# EAGLE design DACv4-Controller (EAGLE 7.6.0)
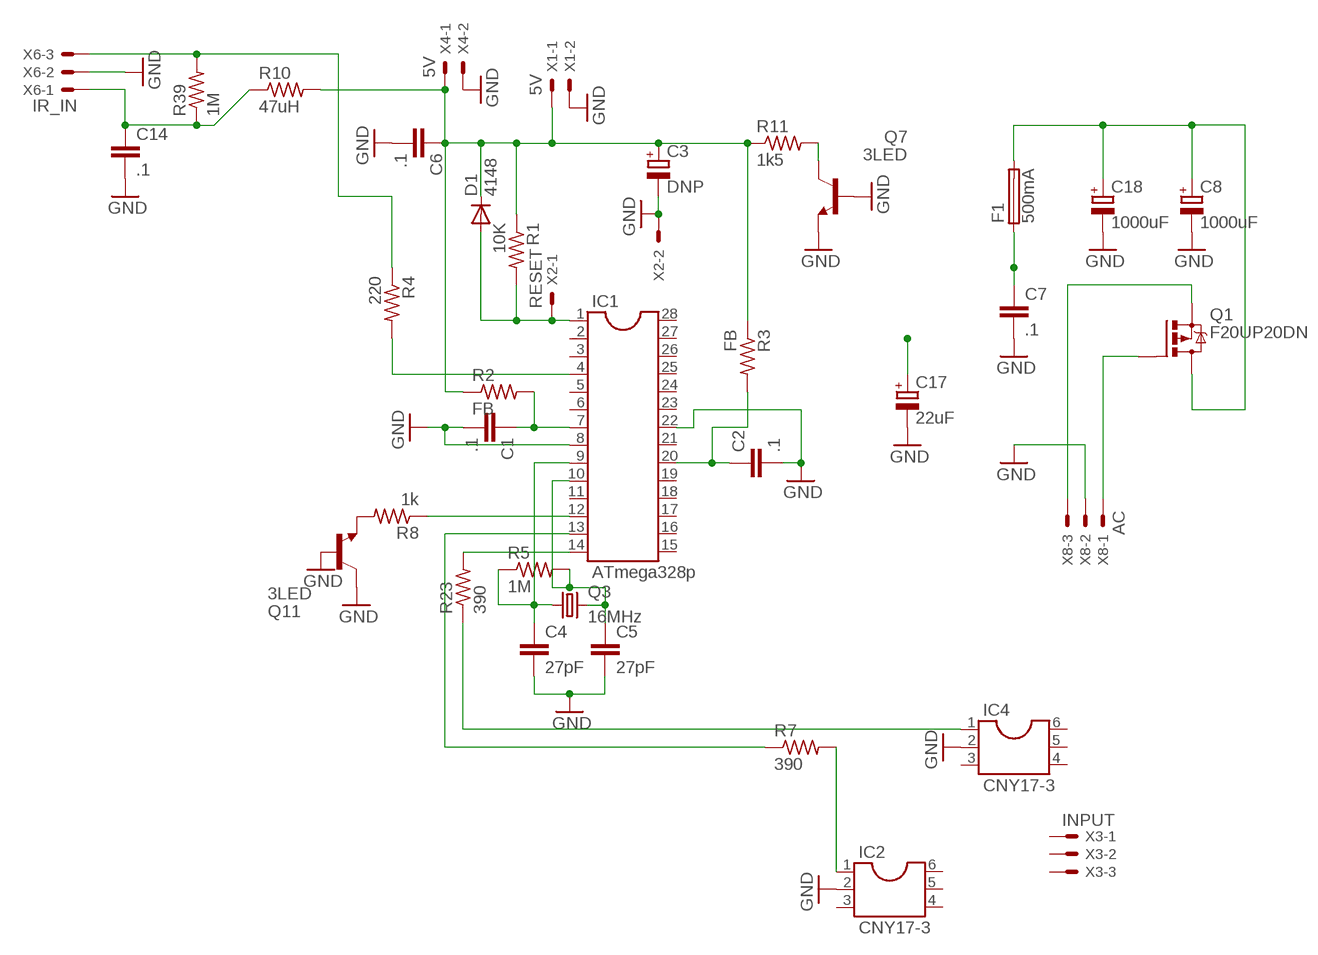
[diagram p0: schematic, sheet 1]

## Parts
C1  .1  C-EUC1210K  [C1210K]
C2  .1  C-EUC1210K  [C1210K]
C3  DNP  CPOL-EUE3.5-10  [E3,5-10]
C4  27pF  C-EUC1210K  [C1210K]
C5  27pF  C-EUC1210K  [C1210K]
C6  .1  C-EUC1210K  [C1210K]
C7  .1  C-EUC1210K  [C1210K]
C8  1000uF  CPOL-EUE5-13  [E5-13]
C14  .1  C-EUC1210K  [C1210K]
C17  22uF  CPOL-EUE3.5-10  [E3,5-10]
C18  1000uF  CPOL-EUE5-13  [E5-13]
D1  4148  1N4148DO35-7  [DO35-7]
F1  500mA  19560  [19560]
IC1  ATmega328p  DIL28-3  [DIL28-3]
IC2  CNY17-3  DIL6  [DIL06]
IC4  CNY17-3  DIL6  [DIL06]
Q1  F20UP20DN  IRF9530  [TO220BV]
Q3  16MHz  CRYSTALHC49S  [HC49/S]
Q7  3LED  BC546A  [TO92-EBC]
Q11  3LED  BC546A  [TO92-EBC]
R1  10K  R-US_0309/10  [0309/10]
R2  FB  R-US_0309/10  [0309/10]
R3  FB  R-US_0309/12  [0309/12]
R4  220  R-US_0309/12  [0309/12]
R5  1M  R-US_0309/V  [0309V]
R7  390  R-US_0309/10  [0309/10]
R8  1k  R-US_0204/7  [0204/7]
R10  47uH  R-US_0309/10  [0309/10]
R11  1k5  R-US_0309/12  [0309/12]
R23  390  R-US_0309/10  [0309/10]
R39  1M  R-US_0309/10  [0309/10]
X1  5V  22-23-2021  [22-23-2021]
X2  RESET  22-23-2021  [22-23-2021]
X3  INPUT  22-23-2031  [22-23-2031]
X4  5V  22-23-2021  [22-23-2021]
X6  IR_IN  22-23-2031  [22-23-2031]
X8  AC  22-23-2031  [22-23-2031]

## Nets
GND: C1.2 C2.2 C3.- C4.2 C5.2 C6.2 C7.2 C8.- C14.2 C17.- C18.- IC1.8 IC1.22 IC2.2 IC4.2 Q7.B Q7.E Q11.B Q11.C X1.2 X2.2 X4.2 X6.2 X8.2
N$1: IC2.1 R7.2
N$2: D1.A IC1.1 R1.2 X2.1
N$3: IC1.4 R4.2
N$4: C2.1 IC1.20 R3.2
N$5: R4.1 R39.2 X6.3
N$7: IC1.13 R7.1
N$8: IC1.12 R8.1
N$13: C4.1 IC1.9 Q3.1 R5.1
N$14: C5.1 IC1.10 Q3.2 R5.2
N$15: C17.+
N$18: C7.1 F1.1
N$20: C14.1 R10.1 R39.1 X6.1
N$22: Q7.C R11.2
N$24: C8.+ C18.+ F1.2 Q1.D
N$25: Q1.S X8.3
N$26: Q1.G X8.1
N$32: C3.+ C6.1 D1.C R1.1 R2.1 R3.1 R10.2 R11.1 X1.1 X4.1
N$35: C1.1 IC1.7 R2.2
N$41: IC1.14 R23.2
N$44: IC4.1 R23.1
N$55: Q11.E R8.2
Unconnected: IC1.2 IC1.3 IC1.5 IC1.6 IC1.11 IC1.15 IC1.16 IC1.17 IC1.18 IC1.19 IC1.21 IC1.23 IC1.24 IC1.25 IC1.26 IC1.27 IC1.28 IC2.3 IC2.4 IC2.5 IC2.6 IC4.3 IC4.4 IC4.5 IC4.6 X3.1 X3.2 X3.3

## Library data of the parts
C1 C2 C4-C7 C14 = resistor:C-EU: CAPACITOR, European symbol
C3 C8 C17 C18 = resistor:CPOL-EU: POLARIZED CAPACITOR, European symbol
D1 = diode:1N4148: DIODE high speed (Philips)
F1 = fuse:19560: FUSE HOLDER TR5, Wickmann; MPN: 56000001009; OC_FARNELL: 1185363; OC_NEWARK: 15P8392
IC1 = ic-package:DIL28: Dual In Line
IC2 IC4 = ic-package:DIL6: Dual In Line / Socket
Q1 = transistor-power:IRF9530: P-CHANNEL HEXFET POWER-MOS-FET Source: http://www.irf.com/product-info/datasheets/data/irf9530.pdf
Q3 = crystal:CRYSTAL: CRYSTAL; OC_FARNELL: 1667008; OC_NEWARK: unknown
Q7 Q11 = transistor-npn:BC546*: NPN Transistor
R1-R5 R7 R8 R10 R11 R23 R39 = resistor:R-US_: RESISTOR, American symbol
X1 X2 X4 = con-molex:22-23-2021: .100" (2.54mm) Center Header - 2 Pin; MF: MOLEX; MPN: 22-23-2021; OC_FARNELL: 1462926; OC_NEWARK: 25C3832
X3 X6 X8 = con-molex:22-23-2031: .100" (2.54mm) Center Header - 3 Pin; MF: MOLEX; MPN: 22-23-2031; OC_FARNELL: 1462950; OC_NEWARK: 30C0862

## Board
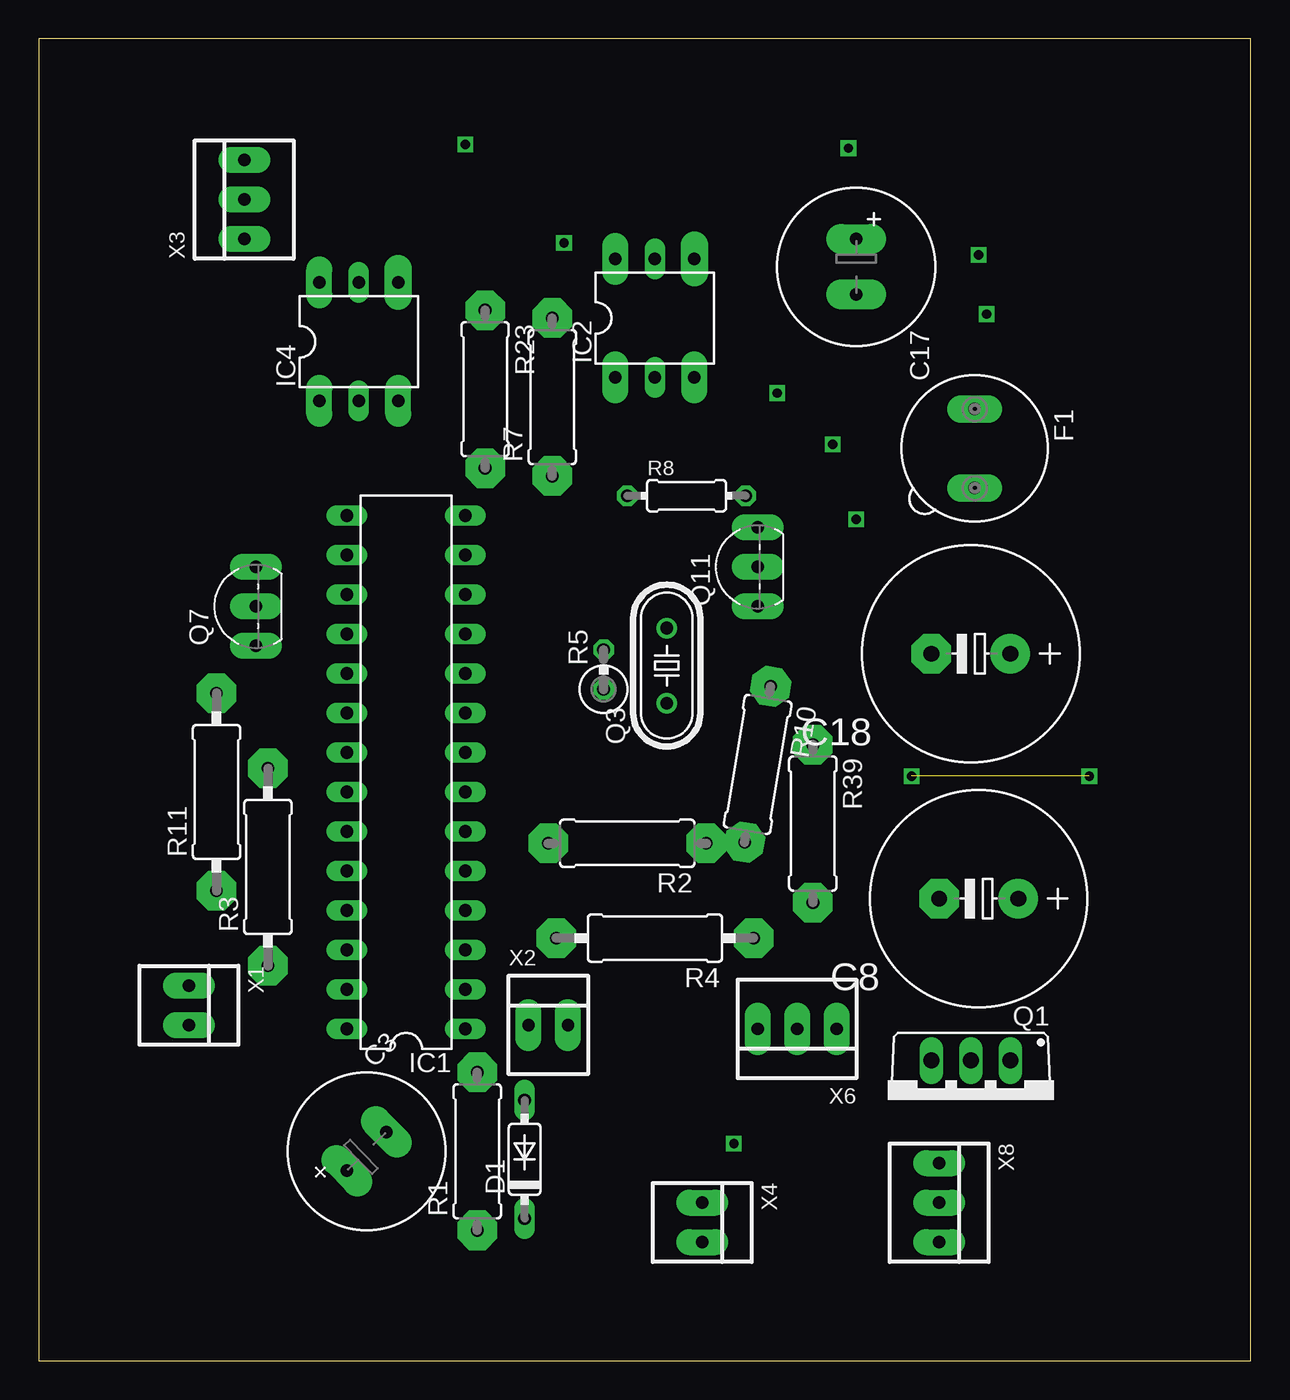
[diagram p1: board, top side]
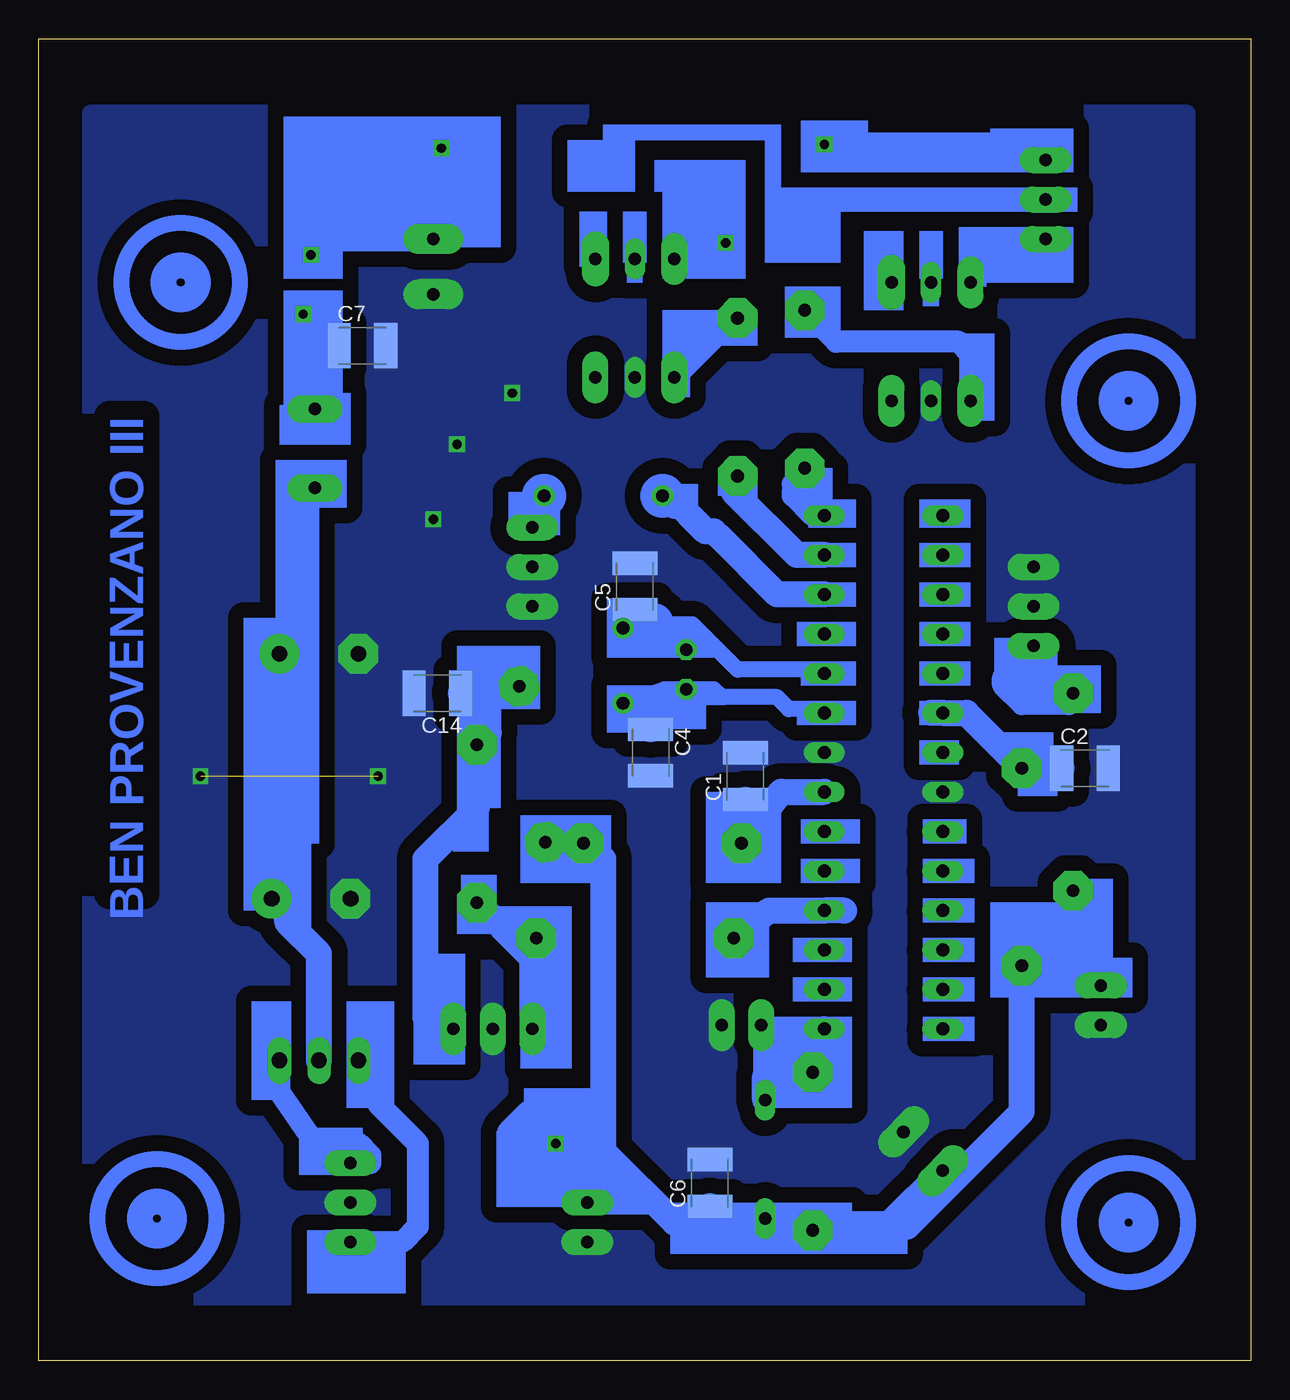
[diagram p2: board, bottom side, seen from below]

Size 77.96 x 85.01 mm. Coordinates in mm from the lower left corner, seen from the top.
Outline: 0,0 77.96,0 77.96,85.01 0,85.01 0,0
Copper layers (1*16): Top 0.035mm / dielectric 1.5mm / Bottom 0.035mm
Design rules "default": minimum track width 10mil, minimum drill 24mil, track to track 8mil, track to pad 8mil, pad to pad 8mil, via to via 8mil, smd to smd 8mil, copper to edge 40mil, drill to drill 8mil, minimum pad ring 10mil, minimum via ring 8mil, stop-mask expansion 4mil, vias tented up to drill 0mil, thermal gap 10mil

### Footprints (pad centres in the part's own frame; a part is rotated, then mirrored left to right if it is on the bottom)
C1210K = smd 1.5 x 2.9: 1 -1.5,0; 2 1.5,0
E3,5-10 = drill 0.813 pad 1.93 long: + -1.778,0; - 1.778,0
E5-13 = drill 1.016 pad 2.54: + -2.54,0 | drill 1.016 pad 2.54 octagon: - 2.54,0
DO35-7 = drill 0.813 long: A 3.81,0; C -3.81,0
19560 = drill 0.813 pad 1.778 long: 1 -2.54,0; 2 2.54,0
DIL28-3 = drill 0.813 long: 1 -16.51,-3.81; 2 -13.97,-3.81; 3 -11.43,-3.81; 4 -8.89,-3.81; 5 -6.35,-3.81; 6 -3.81,-3.81; 7 -1.27,-3.81; 8 1.27,-3.81; 9 3.81,-3.81; 10 6.35,-3.81; 11 8.89,-3.81; 12 11.43,-3.81; 13 13.97,-3.81; 14 16.51,-3.81; 15 16.51,3.81; 16 13.97,3.81; 17 11.43,3.81; 18 8.89,3.81; 19 6.35,3.81; 20 3.81,3.81; 21 1.27,3.81; 22 -1.27,3.81; 23 -3.81,3.81; 24 -6.35,3.81; 25 -8.89,3.81; 26 -11.43,3.81; 27 -13.97,3.81; 28 -16.51,3.81
DIL06 = drill 0.813 pad 1.676 long: 1 -2.54,-3.81; 3 2.54,-3.81; 6 -2.54,3.81 | drill 0.813 long: 2 0,-3.81; 5 0,3.81 | drill 0.813 pad 1.778 long: 4 2.54,3.81
TO220BV = drill 1.016 long: D 0,-2.54; G -2.54,-2.54; S 2.54,-2.54
HC49/S = drill 0.813: 1 -2.413,0; 2 2.413,0
TO92-EBC = drill 0.813 pad 1.676 long: B 0,-1.27; C -2.54,-1.27; E 2.54,-1.27
0309/10 = drill 0.813 pad 2.54 octagon: 1 -5.08,0; 2 5.08,0
0309/12 = drill 0.813 pad 2.54 octagon: 1 -6.35,0; 2 6.35,0
0309V = drill 0.813 octagon: 1 -1.27,0; 2 1.27,0
0204/7 = drill 0.813 octagon: 1 -3.81,0; 2 3.81,0
22-23-2021 = drill 0.8 pad 1.676 long: 1 -1.27,0; 2 1.27,0
22-23-2031 = drill 0.8 pad 1.676 long: 1 -2.54,0; 2 0,0; 3 2.54,0

### Placement (x,y rotation side)
C1  32.51,37.59 90 bottom
C2  10.67,38.1 0 bottom
C3  21.08,13.46 44.6 top
C4  38.61,39.12 270 bottom
C5  39.62,49.78 90 bottom
C6  34.8,11.43 90 bottom
C7  57.15,65.28 0 bottom
C8  60.45,29.72 180 top
C14  52.32,42.93 180 bottom
C17  52.58,70.36 270 top
C18  59.94,45.47 180 top
D1  31.24,12.95 90 top
F1  60.2,58.67 270 top
IC1  23.62,37.85 90 top
IC2  39.62,67.06 0 top
IC4  20.57,65.53 0 top
Q1  59.94,16.76 180 top
Q3  40.39,44.7 90 top
Q7  12.7,48.51 90 top
Q11  44.96,51.05 90 top
R1  28.19,13.46 90 top
R2  37.85,33.27 180 top
R3  14.73,31.75 90 top
R4  39.62,27.18 180 top
R5  36.32,44.45 90 top
R7  33.02,61.98 90 top
R8  41.66,55.63 0 top
R10  46.23,38.35 260.5 top
R11  11.43,36.58 90 top
R23  28.7,62.48 270 top
R39  49.78,34.54 270 top
X1  9.65,22.86 270 top
X2  32.77,21.59 0 top
X3  13.21,74.68 90 top
X4  42.67,8.89 270 top
X6  48.77,21.34 180 top
X8  57.91,10.16 270 top

### Tracks (layer width: path | path; a pad name or v marks a point on that pad's centre or on a via)
GND  (via drill 0.6)  (1 unrouted)
  other vias: 56.13,37.59 47.5,62.23 52.58,54.1 67.56,37.59 51.05,58.93
  pour Bottom (isolate 1.016, no thermals): 4.06,4.06 4.06,80.26 74.68,80.26 74.68,4.06
N$1
  Bottom 1.422: IC2.1 33.27,67.06 R7.2
N$2
  Bottom 1.676: R1.2 27.43,19.3 27.43,20.57 | 27.43,20.57 IC1.1 | X2.1 30.99,20.57 28.96,20.57 | 28.96,20.57 27.43,20.57 | D1.A 31.24,18.29 28.96,20.57
N$3
  Bottom 1.676: R4.2 30.99,28.96 IC1.4 26.16,28.96
N$4
  Bottom 1.676: 20.57,41.66 IC1.20 18.29,41.66 R3.2 C2.1
N$5
  Bottom 1.676: R39.2 46.61,26.29 | 46.61,26.29 46.23,25.91 X6.3 | R4.1 46.36,26.29 46.61,26.29
N$6
  Bottom 1.676: 27.69,8.89 27.43,8.89
N$7
  Bottom 1.422: 33.27,55.88 33.02,55.88 R7.1
  Bottom 1.676: IC1.13 29.21,51.82 33.27,55.88
N$8
  Bottom 1.422: 34.29,53.09 34.54,53.34 | 36.83,54.86 37.08,54.86 R8.1
  Bottom 1.676: IC1.12 30.48,49.28 34.29,53.09 | 34.54,53.34 35.05,53.34 37.34,55.63 R8.1
N$9  (via drill 0.6)
  other vias: 33.78,71.88
N$10  (via drill 0.6)
  other vias: 27.43,78.23
N$11
  Bottom 1.422: 42.67,16 46.48,16 47.75,14.73 47.75,13.72 47.5,13.46 46.23,14.73
N$12  (via drill 0.6)
  other vias: 44.7,13.97
N$13
  Bottom 1.016: IC1.9 27.69,41.91 29.72,41.91 30.48,42.67 34.04,42.67 34.54,43.18 R5.1 37.59,43.18 37.72,43.18 Q3.1
  Bottom 1.676: 38.08,42.67 C4.1 38.51,42.39 Q3.1
N$14
  Bottom 1.016: IC1.10 27.43,44.45 33.02,44.45 35.92,47.35 38.86,47.35 | Q3.2 36.7,45.72 R5.2 | C5.1 40.58,47.33 39.36,47.33
  Bottom 1.676: Q3.2 38.86,47.35 39.36,47.33
N$16  (via drill 0.6)
  other vias: 52.07,77.98
N$17  (via drill 0.6)
  other vias: 60.45,71.12
N$18
  Bottom 1.016: C7.1 58.9,65.02 60.96,65.02 60.2,64.26 F1.1
N$19  (via drill 0.6)
  other vias: 60.96,67.31
N$20
  Bottom 1.676: 49.02,43.43 49.02,40.39 R39.1 49.78,35.56 53.09,32.26 53.09,22.1 X6.1 | 49.02,43.43 C14.1 | R10.1 49.02,43.43
N$22
  Bottom 1.27: R11.2 11.68,42.67 11.68,42.16 14.73,42.16 16,43.43 16,43.94 Q7.C
N$24
  Bottom 1.422: F1.2 61.98,52.83 61.98,45.72 | 61.98,45.72 C8.+ | C18.+ 61.98,45.72
  Bottom 1.676: Q1.D 59.94,26.16 61.98,28.19 61.98,29.72 62.99,30.73 C8.+
N$25
  Bottom 1.422: Q1.S 56.13,18.03 56.13,16.51 53.59,13.97 53.59,8.64 54.61,7.62 X8.3
N$26
  Bottom 1.422: Q1.G 62.48,17.27 60.2,13.97 57.4,13.97 56.64,13.21 56.64,12.7 X8.1
N$32
  Bottom 1.27: 11.43,28.7 11.68,28.7 11.68,30.48 11.43,30.48 11.43,29.97 11.18,29.97 11.18,24.13 X1.1
  Bottom 1.422: X4.1 42.16,12.7 41.53,13.34
  Bottom 1.676: R10.2 R2.1 41.66,32.26 41.66,13.46 41.53,13.34 37.08,8.89 35.05,8.89 | 35.05,8.89 28.7,8.89 | 28.7,8.89 28.58,8.76 | C6.1 34.8,9.14 35.05,8.89 | D1.C 28.96,9.14 28.7,8.89 | 28.58,8.76 R1.1 | 28.58,8.76 23.27,8.76 C3.+ 23.11,8.92 23.11,8.89 22.86,8.64 22.1,8.64 14.73,16 R3.1 11.43,28.7 11.43,29.97 R11.1
N$35
  Bottom 1.676: C1.1 R2.2 | 33.02,31.98 R2.2 | R2.2 30.23,36.58 IC1.7
N$41
  Bottom 1.422: 29.46,56.39 29.46,55.88 | 29.46,55.88 29.46,55.63 28.19,54.36 IC1.14 | 28.45,56.39 28.96,56.39 28.96,55.88 29.46,55.88
  Bottom 1.676: R23.2 28.45,57.4 28.45,56.39
N$44
  Bottom 1.422: IC4.1 18.03,64.77 18.8,65.53 26.67,65.53 R23.1
N$55
  Bottom 1.676: Q11.E 45.47,54.36 R8.2
(copper drawn outside any net)
  shapes: Bottom area x215, Bottom circle x15

### Text on the board
Bottom: BEN PROVENZANO III